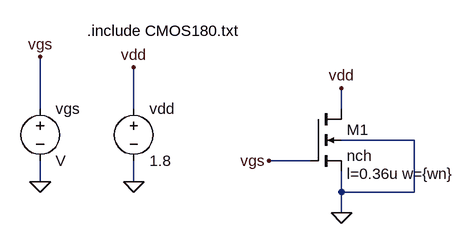
[diagram p0: schematic Draft1.asc]
Draft1.asc, the LTspice schematic file:
Version 4
SHEET 1 880 680
WIRE -192 160 -192 80
WIRE -48 160 -48 96
WIRE 272 160 272 128
WIRE 384 208 272 208
WIRE 224 240 160 240
WIRE -192 272 -192 240
WIRE -48 272 -48 240
WIRE 272 288 272 256
WIRE 384 288 384 208
WIRE 384 288 272 288
WIRE 272 320 272 288
FLAG 272 320 0
FLAG -48 272 0
FLAG -48 96 vdd
FLAG 272 128 vdd
FLAG 160 240 vgs
FLAG -192 272 0
FLAG -192 80 vgs
SYMBOL nmos4 224 160 R0
WINDOW 123 56 100 Left 2
SYMATTR InstName M1
SYMATTR Value nch
SYMATTR Value2 l=0.36u w={wn}
SYMBOL voltage -48 144 R0
WINDOW 123 0 0 Left 0
WINDOW 39 0 0 Left 0
SYMATTR InstName vdd
SYMATTR Value 1.8
SYMBOL voltage -192 144 R0
SYMATTR InstName vgs
TEXT -120 40 Left 2 !.include CMOS180.txt

The netlist it stands for:
* Draft1.asc
M1 vdd vgs 0 0 nch l=0.36u w={wn}
vdd vdd 0 1.8
vgs vgs 0 V
.model NMOS NMOS
.model PMOS PMOS
.lib standard.mos
.include CMOS180.txt
.backanno
.end